# EAGLE design Lu_version2 (EAGLE 7.5.0)
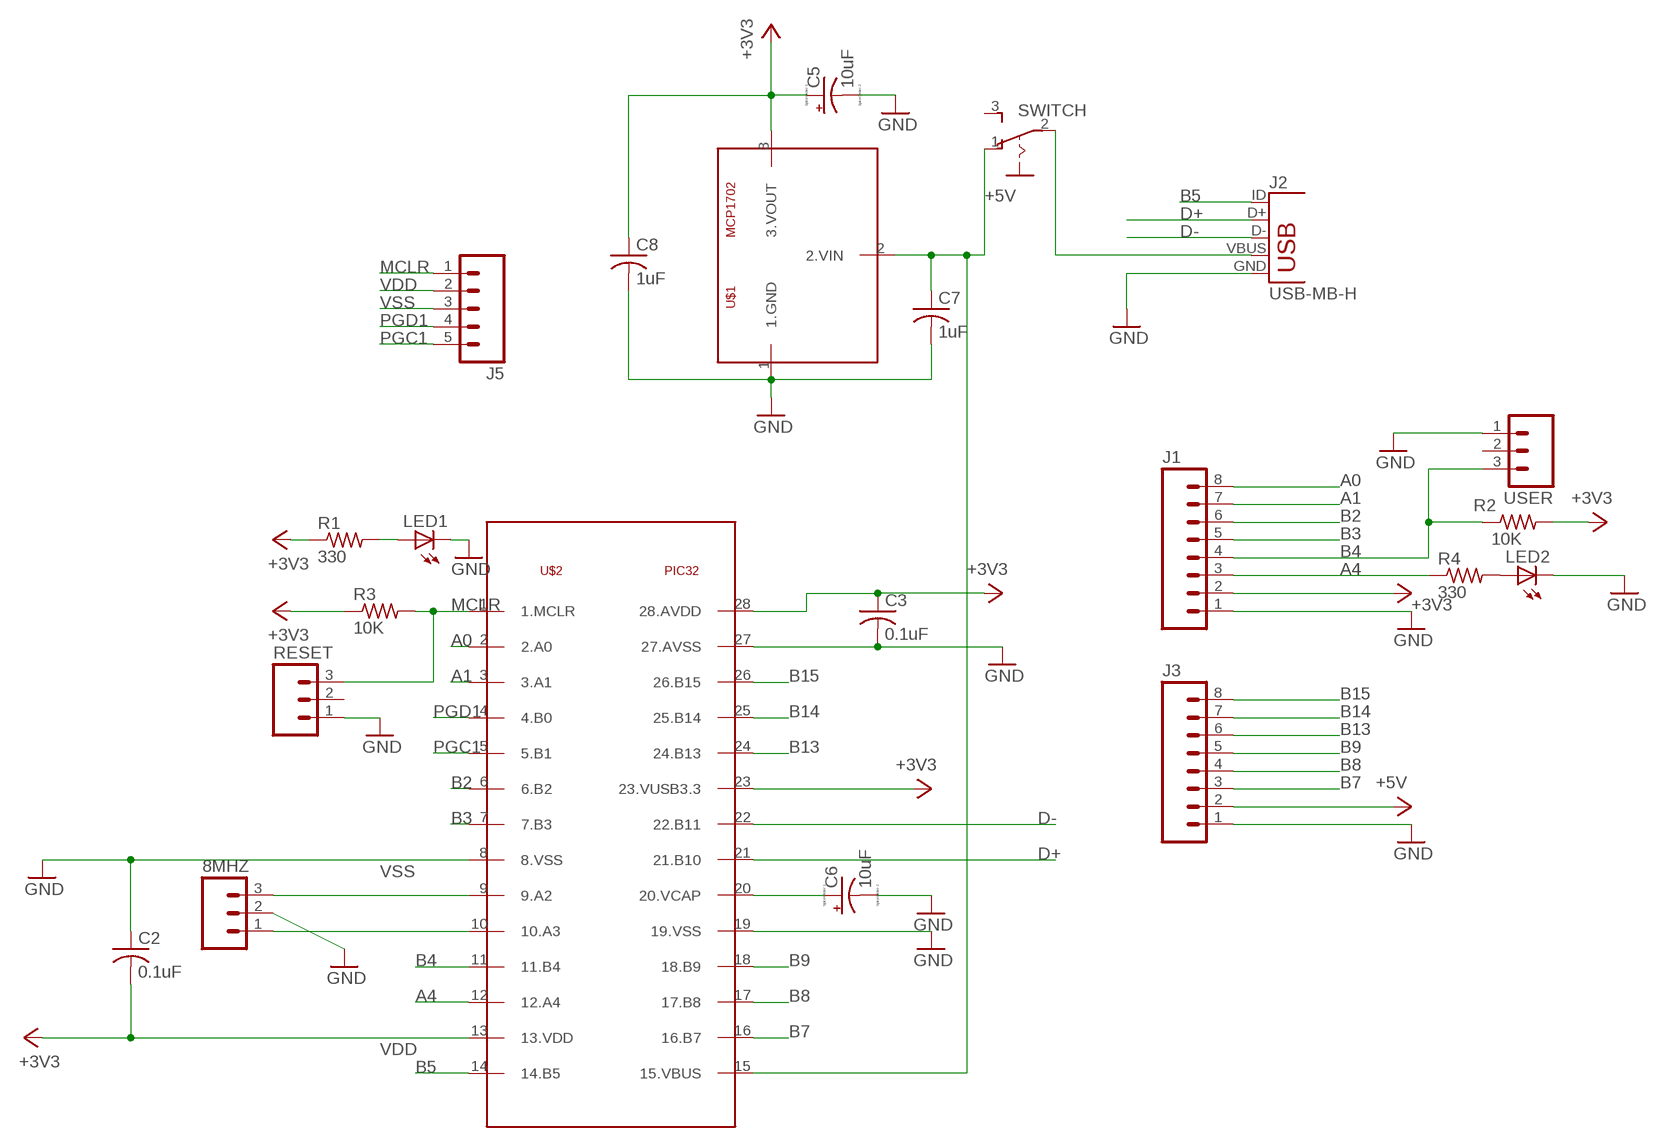
[diagram p0: schematic, sheet 1]

## Parts
8MHZ  M03PTH  [1X03]
C2  0.1uF  C-US025-030X050  [C025-030X050]
C3  0.1uF  C-US025-030X050  [C025-030X050]
C5  10uF  CPOL-USB45181A  [B45181A]
C6  10uF  CPOL-USB45181A  [B45181A]
C7  1uF  C-US025-030X050  [C025-030X050]
C8  1uF  C-US025-030X050  [C025-030X050]
J1  M08  [1X08_ROUND]
J2  USB-MB-H  [USB-MB-H]
J3  M08  [1X08_ROUND]
J5  M05PTH  [1X05]
LED1  LED3MM  [LED3MM]
LED2  LED3MM  [LED3MM]
R1  330  R-US_0207/10  [0207/10]
R2  10K  R-US_0207/10  [0207/10]
R3  10K  R-US_0207/10  [0207/10]
R4  330  R-US_0207/10  [0207/10]
RESET  M03PTH  [1X03]
SWITCH  255SB  [255SB]
U$1  MCP1702  [TO92]
U$2  PIC32  [DIL28-3]
USER  M03PTH  [1X03]

## Nets
+3V3: C3.1 C5.+ C8.1 J1.2 R1.1 R2.2 R3.1 U$1.3(3.VOUT) U$2.23(23.VUSB3.3) U$2.28(28.AVDD)
+5V: C7.1 J3.2 SWITCH.1(O) U$1.2(2.VIN) U$2.15(15.VBUS)
A0: J1.8 U$2.2(2.A0)
A1: J1.7 U$2.3(3.A1)
A4: J1.3 R4.1 U$2.12(12.A4)
B2: J1.6 U$2.6(6.B2)
B3: J1.5 U$2.7(7.B3)
B4: J1.4 R2.1 U$2.11(11.B4) USER.3
B5: J2.ID U$2.14(14.B5)
B7: J3.3 U$2.16(16.B7)
B8: J3.4 U$2.17(17.B8)
B9: J3.5 U$2.18(18.B9)
B13: J3.6 U$2.24(24.B13)
B14: J3.7 U$2.25(25.B14)
B15: J3.8 U$2.26(26.B15)
D+: J2.D+ U$2.21(21.B10)
D-: J2.D- U$2.22(22.B11)
GND: 8MHZ.2 C3.2 C5.- C6.- C7.2 C8.2 J1.1 J2.GND J3.1 LED1.K(C) LED2.K(C) RESET.1 U$1.1(1.GND) U$2.19(19.VSS) U$2.27(27.AVSS) USER.1
MCLR: J5.1 R3.2 RESET.3 U$2.1(1.MCLR)
N$1: J2.VBUS SWITCH.2(P)
N$2: LED1.A R1.2
N$3: 8MHZ.3 U$2.9(9.A2)
N$4: LED2.A R4.2
N$5: 8MHZ.1 U$2.10(10.A3)
N$10: C6.+ U$2.20(20.VCAP)
PGC1: J5.5 U$2.5(5.B1)
PGD1: J5.4 U$2.4(4.B0)
VDD: C2.2 J5.2 U$2.13(13.VDD) ; supply symbol labelled +3V3
VSS: C2.1 J5.3 U$2.8(8.VSS) ; supply symbol labelled GND
Unconnected: RESET.2 SWITCH.3(S) USER.2

## Library data of the parts
8MHZ RESET USER = Lu_hw2:M03: Header 3 Standard 3-pin 0.1" header. Use with straight break away headers (SKU : PRT-00116), right angle break away headers (PRT-00553), swiss pins (PRT-00743), machine pins (PRT-00117), and female headers (PRT-00115). Molex polarized connector foot print use with SKU : PRT-08232 with associated crimp pins and housings.
C2 C3 C7 C8 = Lu_hw2:C-US: CAPACITOR, American symbol
C5 C6 = Lu_hw2:CPOL-US: POLARIZED CAPACITOR, American symbol
J1 J3 = Lu_hw2:M08: Header 8 Standard 8-pin 0.1" header. Use with straight break away headers (SKU : PRT-00116), right angle break away headers (PRT-00553), swiss pins (PRT-00743), machine pins (PRT-00117), and female headers (PRT-00115).; PROD_ID: CONN-08437
J2 = Lu_hw2:USB: USB Connectors USB-B-PTH is fully proven SKU : PRT-00139/CONN-08278 USB-miniB is fully proven SKU : PRT-00587 USB-A-PCB is untested. USB-A-H is throughly reviewed, but untested. Spark Fun Electronics SKU : PRT-00437 USB-B-SMT is throughly reviewed, but untested. Needs silkscreen touching up. USB-A-S has not been used/tested USB-MB-H has not been used/tested USB-MICROB has been used. CONN-09505
J5 = Lu_hw2:M05: Header 5 Standard 5-pin 0.1" header. Use with straight break away headers (SKU : PRT-00116), right angle break away headers (PRT-00553), swiss pins (PRT-00743), machine pins (PRT-00117), and female headers (PRT-00115). Molex polarized connector foot print use with SKU : PRT-08230 with associated crimp pins and housings.
LED1 LED2 = Lu_hw2:LED: LED OSRAM: - CHIPLED LG R971, LG N971, LY N971, LG Q971, LY Q971, LO R971, LY R971 LH N974, LH R974 LS Q976, LO Q976, LY Q976 LO Q996 - Hyper CHIPLED LW Q18S LB Q993, LB Q99A, LB R99A - SideLED LS A670, LO A670, LY A670, LG A670, LP A670 LB A673, LV A673, LT A673, LW A673 LH A674 LY A675 LS A676, LA A676, LO A676, LY A676, LW A676 LS A679, LY A679, LG A679 - Hyper Micro SIDELED® LS Y876, LA Y876, LO Y876, LY Y876 LT Y87S - SmartLED LW L88C, LW L88S LB L89C, LB L89S, LG L890 LS L89K, LO L89K, LY L89K LS L896, LA L896, LO L896, LY L896 - TOPLED LS T670, LO T670, LY T670, LG T670, LP T670 LSG T670, LSP T670, LSY T670, LOP T670, LYG T670 LG T671, LOG T671, LSG T671 LB T673, LV T673, LT T673, LW T673 LH T674 LS T676, LA T676, LO T676, LY T676, LB T676, LH T676, LSB T676, LW T676 LB T67C, LV T67C, LT T67C, LS T67K, LO T67K, LY T67K, LW E67C LS E67B, LA E67B, LO E67B, LY E67B, LB E67C, LV E67C, LT E67C LW T67C LS T679, LY T679, LG T679 LS T770, LO T770, LY T770, LG T770, LP T770 LB T773, LV T773, LT T773, LW T773 LH T774 LS E675, LA E675, LY E675, LS T675 LS T776, LA T776, LO T776, LY T776, LB T776 LHGB T686 LT T68C, LB T68C - Hyper Mini TOPLED® LB M676 - Mini TOPLED Santana® LG M470 LS M47K, LO M47K, LY M47K Source: http://www.osram.convergy.de LUXEON: - LUMILED® LXK2-PW12-R00, LXK2-PW12-S00, LXK2-PW14-U00, LXK2-PW14-V00 LXK2-PM12-R00, LXK2-PM12-S00, LXK2-PM14-U00 LXK2-PE12-Q00, LXK2-PE12-R00, LXK2-PE12-S00, LXK2-PE14-T00, LXK2-PE14-U00 LXK2-PB12-K00, LXK2-PB12-L00, LXK2-PB12-M00, LXK2-PB14-N00, LXK2-PB14-P00, LXK2-PB14-Q00 LXK2-PR12-L00, LXK2-PR12-M00, LXK2-PR14-Q00, LXK2-PR14-R00 LXK2-PD12-Q00, LXK2-PD12-R00, LXK2-PD12-S00 LXK2-PH12-R00, LXK2-PH12-S00 LXK2-PL12-P00, LXK2-PL12-Q00, LXK2-PL12-R00 Source: www.luxeon.com KINGBRIGHT: KA-3528ASYC Source: www.kingbright.com
R1-R4 = Lu_hw2:R-US_: RESISTOR, American symbol
SWITCH = Lu_hw2:255SB: SLIDING SWITCH Distributor Buerklin, 11G810
U$1 = Lu_hw2:MCP1702
U$2 = Lu_hw2:PIC32

## Board
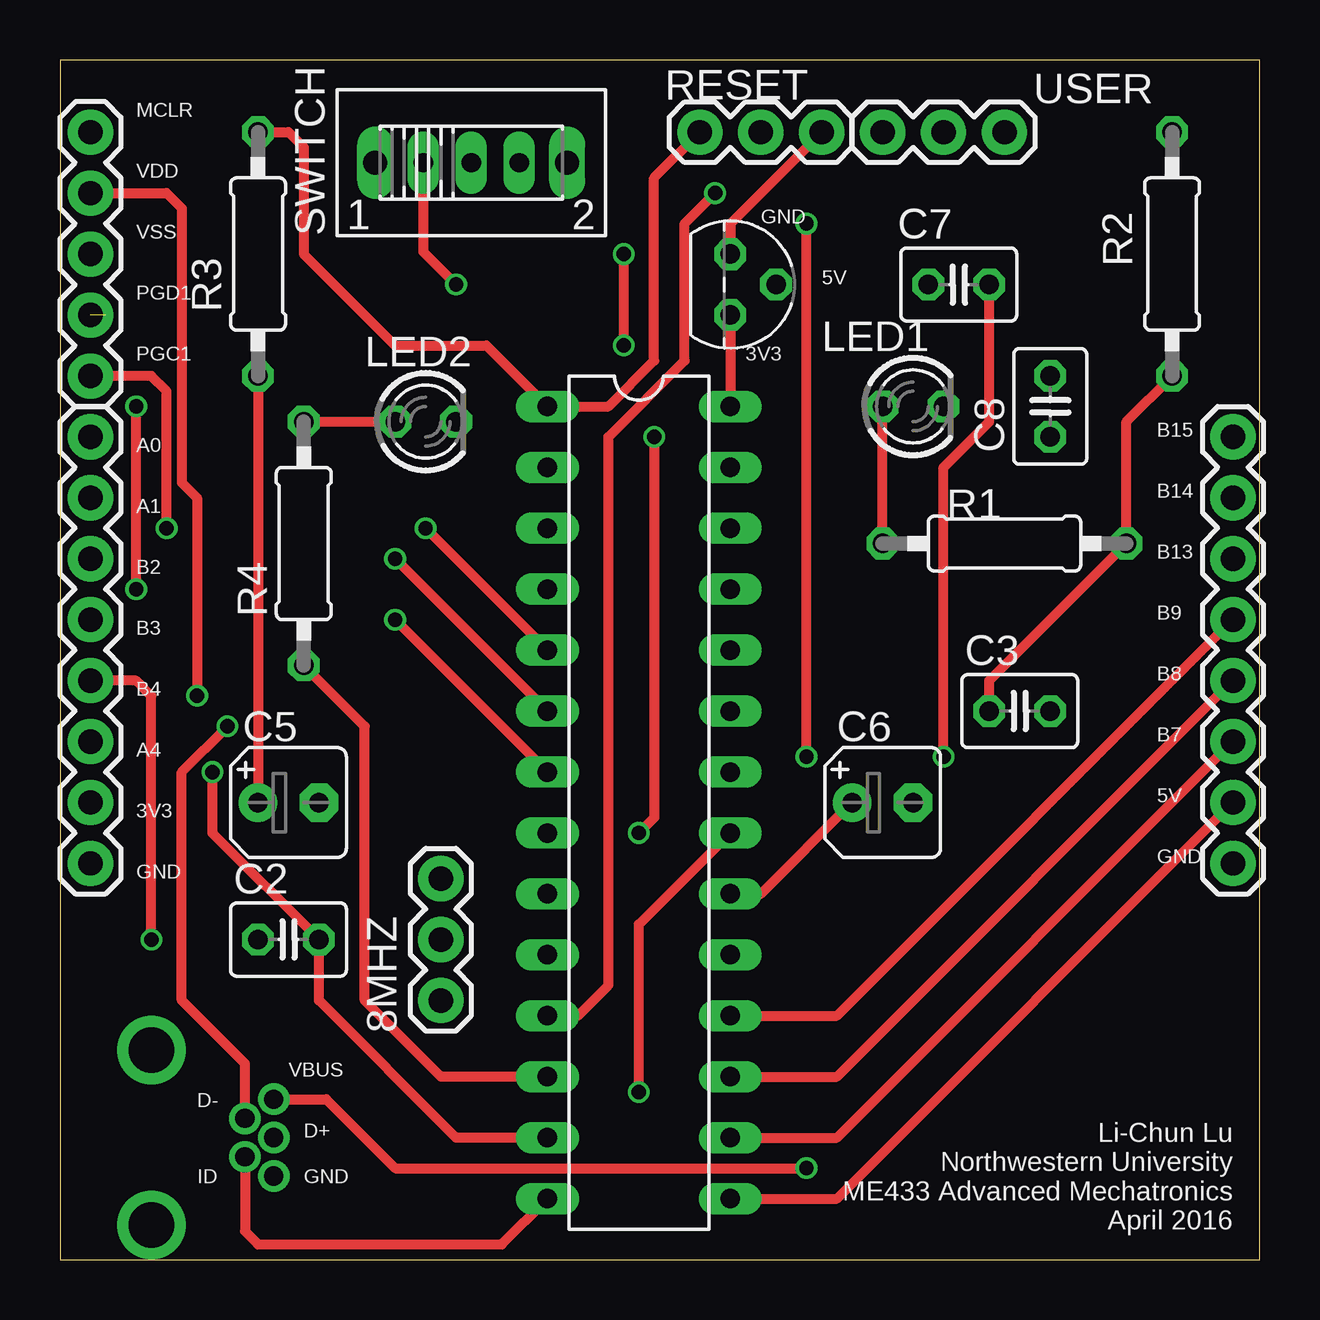
[diagram p1: board, top side]
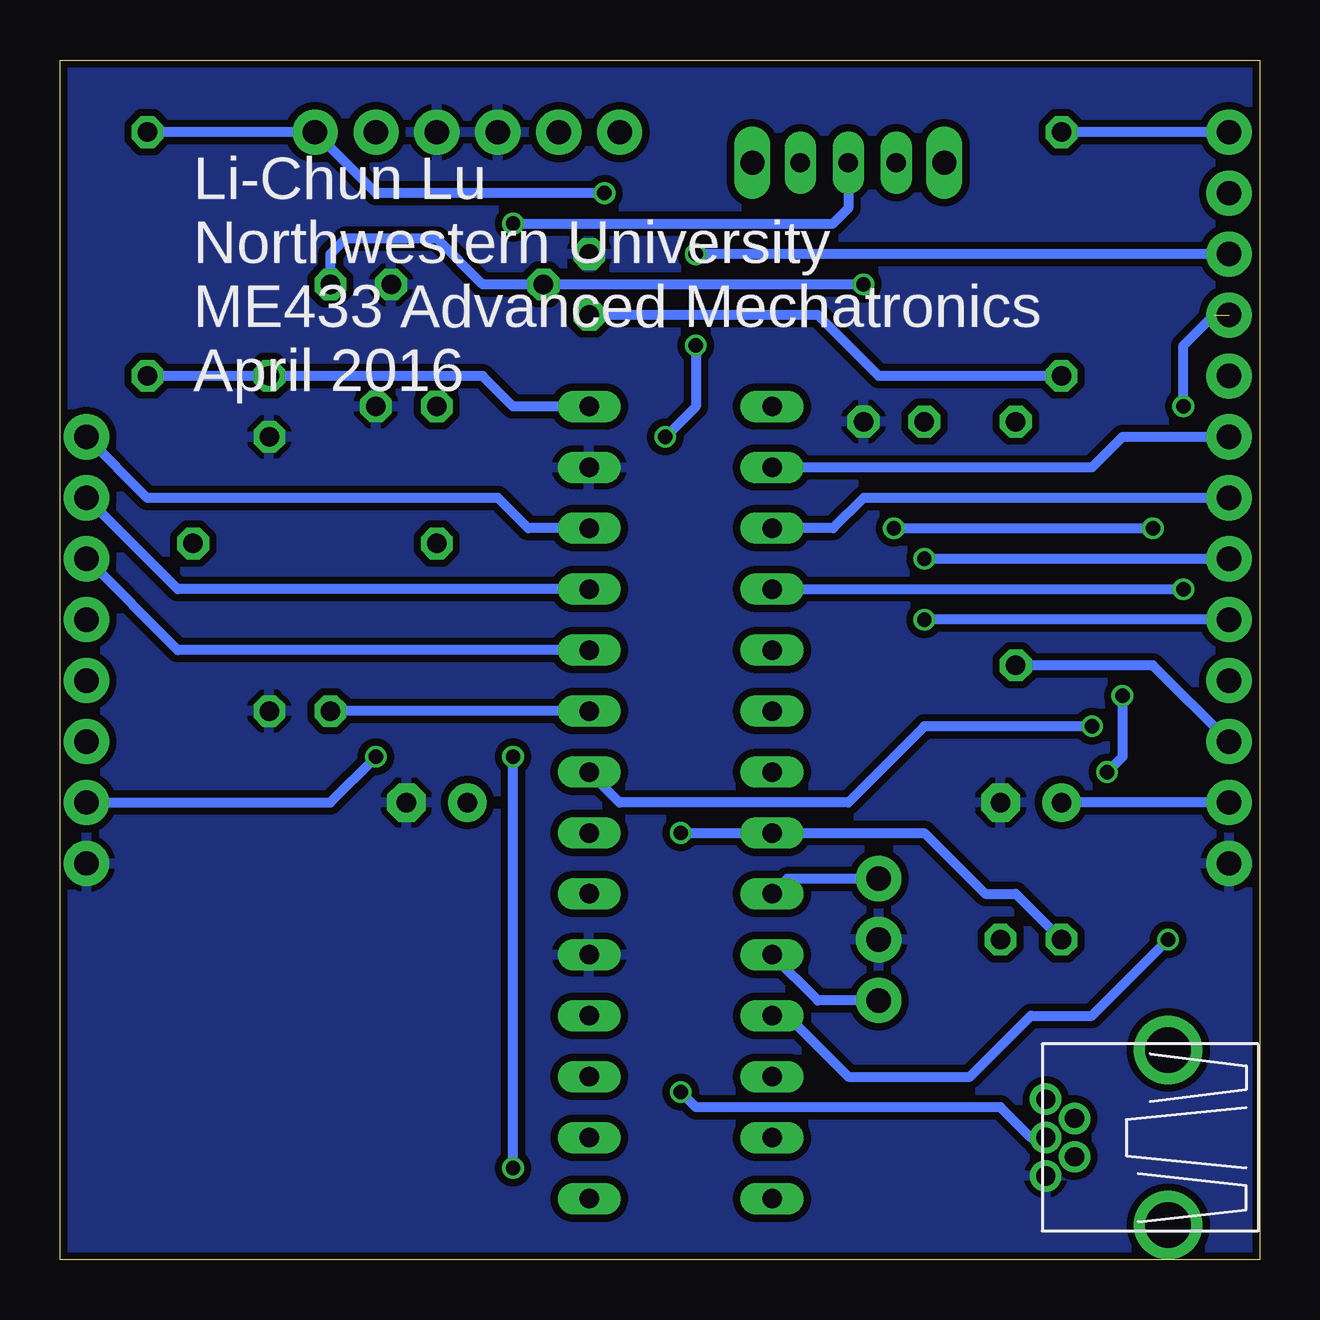
[diagram p2: board, bottom side, seen from below]

Size 50 x 50 mm. Coordinates in mm from the lower left corner, seen from the top.
Outline: 0,0 50,0 50,50 0,50 0,0
Copper layers (1*16): Top 0.035mm / dielectric 1.5mm / Bottom 0.035mm
Design rules "SeeedStudio_2layer_DRU_no_angle_20140221": minimum track width 6mil, minimum drill 12mil, track to track 6mil, track to pad 6mil, pad to pad 6mil, via to via 6mil, smd to smd 0mil, copper to edge 10mil, drill to drill 10mil, minimum pad ring 10mil, minimum via ring 6mil, stop-mask expansion 2mil, vias tented up to drill 100mil, thermal gap 10mil

### Footprints (pad centres in the part's own frame; a part is rotated, then mirrored left to right if it is on the bottom)
1X03 = drill 1.016 pad 1.88: 1 0,0; 2 2.54,0; 3 5.08,0
C025-030X050 = drill 0.813 octagon: 1 -1.27,0; 2 1.27,0
B45181A = drill 0.813 pad 1.6: + -1.27,0 | drill 0.813 pad 1.6 octagon: - 1.27,0
1X08_ROUND = drill 1.016 pad 1.88: 1 0,0; 2 2.54,0; 3 5.08,0; 4 7.62,0; 5 10.16,0; 6 12.7,0; 7 15.24,0; 8 17.78,0
USB-MB-H = drill 0.8: D+ 5.1,0; D- 3.9,0.8; GND 5.1,-1.6; ID 3.9,-0.8; VBUS 5.1,1.6 | drill 1.9: P$6 0,-3.65; P$7 0,3.65
1X05 = drill 1.016 pad 1.88: 1 0,0; 2 2.54,0; 3 5.08,0; 4 7.62,0; 5 10.16,0
LED3MM = drill 0.813 octagon: A -1.27,0; K 1.27,0
0207/10 = drill 0.813 octagon: 1 -5.08,0; 2 5.08,0
255SB = drill 0.8 long: 1 -2,0; 2 0,0; 3 2,0 | drill 1 long: P$1 -4,0; P$2 4,0
TO92 = drill 0.813 octagon: 1 -1.27,0; 2 0,1.905; 3 1.27,0
DIL28-3 = drill 0.813 long: 1 -16.51,-3.81; 2 -13.97,-3.81; 3 -11.43,-3.81; 4 -8.89,-3.81; 5 -6.35,-3.81; 6 -3.81,-3.81; 7 -1.27,-3.81; 8 1.27,-3.81; 9 3.81,-3.81; 10 6.35,-3.81; 11 8.89,-3.81; 12 11.43,-3.81; 13 13.97,-3.81; 14 16.51,-3.81; 15 16.51,3.81; 16 13.97,3.81; 17 11.43,3.81; 18 8.89,3.81; 19 6.35,3.81; 20 3.81,3.81; 21 1.27,3.81; 22 -1.27,3.81; 23 -3.81,3.81; 24 -6.35,3.81; 25 -8.89,3.81; 26 -11.43,3.81; 27 -13.97,3.81; 28 -16.51,3.81

### Placement (x,y rotation side)
8MHZ  15.88,10.79 90 top
C2  9.53,13.34 0 top
C3  40.01,22.86 0 top
C5  9.53,19.05 0 top
C6  34.29,19.05 0 top
C7  37.47,40.64 180 top
C8  41.27,35.56 270 top
J1  1.27,16.51 90 top
J2  3.81,5.08 0 top
J3  48.9,16.51 90 top
J5  1.27,46.99 270 top
LED1  35.56,35.56 0 top
LED2  15.24,34.92 0 top
R1  39.37,29.84 180 top
R2  46.35,41.91 270 top
R3  8.26,41.91 90 top
R4  10.16,29.84 90 top
RESET  31.75,46.99 180 top
SWITCH  17.14,45.72 0 top
U$1  27.94,40.64 270 top
U$2  24.13,19.05 270 top
USER  34.29,46.99 0 top

### Tracks (layer width: path | path; a pad name or v marks a point on that pad's centre or on a via)
+3V3
  Top 0.406: C3.1 38.73,24.13 R1.1 44.45,34.92 R2.2 | U$1.3 U$2.28 | R3.1 C5.+
  Bottom 0.406: R2.2 C8.1 32.38,36.83 31.11,35.56 U$2.28 | U$2.23 C3.1 | R3.1 15.88,36.83 18.41,39.37 U$1.3 | J1.2 C5.+
+5V  (via drill 0.6)
  Top 0.406: U$2.15 32.38,2.54 J3.2 | v36.83,20.95 36.83,33.02 38.73,34.92 C7.1 | SWITCH.1 15.14,42.01 v16.51,40.64
  Bottom 0.406: J3.2 38.73,19.05 v36.83,20.95 | v16.51,40.64 U$1.2 32.38,40.64 34.29,42.55 38.1,42.55 38.73,41.91 C7.1
A0
  Bottom 0.406: J1.8 5.71,34.29 6.99,33.02 U$2.2
A1
  Bottom 0.406: J1.7 16.51,31.75 17.78,30.48 U$2.3
A4
  Top 0.406: U$2.12 15.88,7.62 12.7,10.79 12.7,22.23 R4.1
  Bottom 0.406: J1.3 4.45,24.77 R4.1
B2  (via drill 0.6)
  Top 0.406: U$2.6 v13.97,29.21
  Bottom 0.406: v13.97,29.21 J1.6
B3  (via drill 0.6)
  Top 0.406: v13.97,26.67 U$2.7
  Bottom 0.406: J1.5 v13.97,26.67
B4  (via drill 0.6)
  Top 0.406: v3.81,13.34 3.81,23.5 3.17,24.13 J1.4 | U$2.11 21.59,10.16 22.86,11.43 22.86,34.29 26.04,37.47 26.04,43.18 v27.3,44.45
  Bottom 0.406: R2.1 USER.3 36.83,44.45 v27.3,44.45 | U$2.11 19.68,10.16 17.14,7.62 12.06,7.62 9.53,10.16 6.99,10.16 v3.81,13.34
B5
  Top 0.406: J2.ID 7.71,1.18 8.26,0.64 18.41,0.64 U$2.14
B7
  Top 0.406: U$2.16 32.38,5.08 J3.3
B8
  Top 0.406: U$2.17 32.38,7.62 J3.4
B9
  Top 0.406: U$2.18 32.38,10.16 J3.5
B13
  Bottom 0.406: U$2.24 45.09,25.4 J3.6
B14
  Bottom 0.406: U$2.25 45.09,27.94 J3.7
B15
  Bottom 0.406: U$2.26 30.48,30.48 31.75,31.75 46.35,31.75 J3.8
D+  (via drill 0.6)
  Top 0.406: v24.13,6.99 24.13,13.97 U$2.21
  Bottom 0.406: J2.D+ 9.53,5.08 10.79,6.35 23.5,6.35 v24.13,6.99
D-  (via drill 0.6)
  Top 0.406: J2.D- 7.71,8.16 5.08,10.79 5.08,20.32 v6.99,22.23
  Bottom 0.406: v6.99,22.23 13.97,22.23 17.14,19.05 26.67,19.05 U$2.22
GND
  Top 0.406: RESET.1 27.94,43.18 U$1.1
  pour Bottom (isolate 0.305): 0,50.16 0,0 50.16,0 50.16,50.16
MCLR
  Top 0.406: RESET.3 24.77,45.09 24.77,37.47 22.86,35.56 U$2.1 17.78,38.1 13.97,38.1 10.16,41.91 10.16,46.35 9.53,46.99 R3.2
  Bottom 0.406: J5.1 R3.2
N$1  (via drill 0.6)
  Top 0.406: J2.VBUS 11.1,6.68 13.97,3.81 v31.11,3.81 | v31.11,20.95 v31.11,43.18
  Bottom 0.406: v31.11,3.81 v31.11,20.95 | v31.11,43.18 17.78,43.18 17.14,43.81 SWITCH.2
N$2
  Top 0.406: R1.2 LED1.A
N$3
  Bottom 0.406: 8MHZ.3 19.68,15.88 U$2.9
N$4
  Top 0.406: R4.2 LED2.A
N$5
  Bottom 0.406: 8MHZ.1 18.41,10.79 U$2.10
N$10
  Top 0.406: U$2.20 29.21,15.24 C6.+
PGC1  (via drill 0.6)
  Top 0.406: U$2.5 v15.24,30.48 | v4.45,30.48 4.45,36.2 3.81,36.83 J5.5
  Bottom 0.406: v15.24,30.48 v4.45,30.48
PGD1  (via drill 0.6)  (1 unrouted)
  Top 0.406: v3.17,27.94 v3.17,35.56
  Bottom 0.406: U$2.4 v3.17,27.94 | v3.17,35.56 3.17,38.1 1.91,39.37
VDD  (via drill 0.6)
  Top 0.406: U$2.13 16.51,5.08 10.79,10.79 C2.2 6.35,17.78 v6.35,20.32 | J5.2 4.45,44.45 5.08,43.81 5.08,32.38 5.71,31.75 v5.71,23.5
  Bottom 0.406: v5.71,23.5 5.71,20.95 v6.35,20.32
VSS  (via drill 0.6)
  Top 0.406: v23.5,41.91 v23.5,38.1 | v24.77,34.29 24.77,18.41 v24.13,17.78
  Bottom 0.406: C2.1 10.16,15.24 11.43,15.24 13.97,17.78 U$2.8 v24.13,17.78 | J5.3 v23.5,41.91 | v23.5,38.1 23.5,35.56 v24.77,34.29

### Text on the board
tPlace: MCLR | VDD | VSS | GND | 5V | PGD1 | PGC1 | 3V3 | A0 | B15 | B14 | A1 | B2 | B13 | B9 | B3 | B8 | B4 | B7 | A4 | 5V | 3V3 | GND | GND | VBUS | D- | Li-Chun Lu / Northwestern University / ME433 Advanced Mechatronics / April 2016 | D+ | ID | GND
bPlace: Li-Chun Lu / Northwestern University / ME433 Advanced Mechatronics / April 2016